# EAGLE design utilidong-lipo-charger-mk-2.1 (EAGLE 6.5.0)
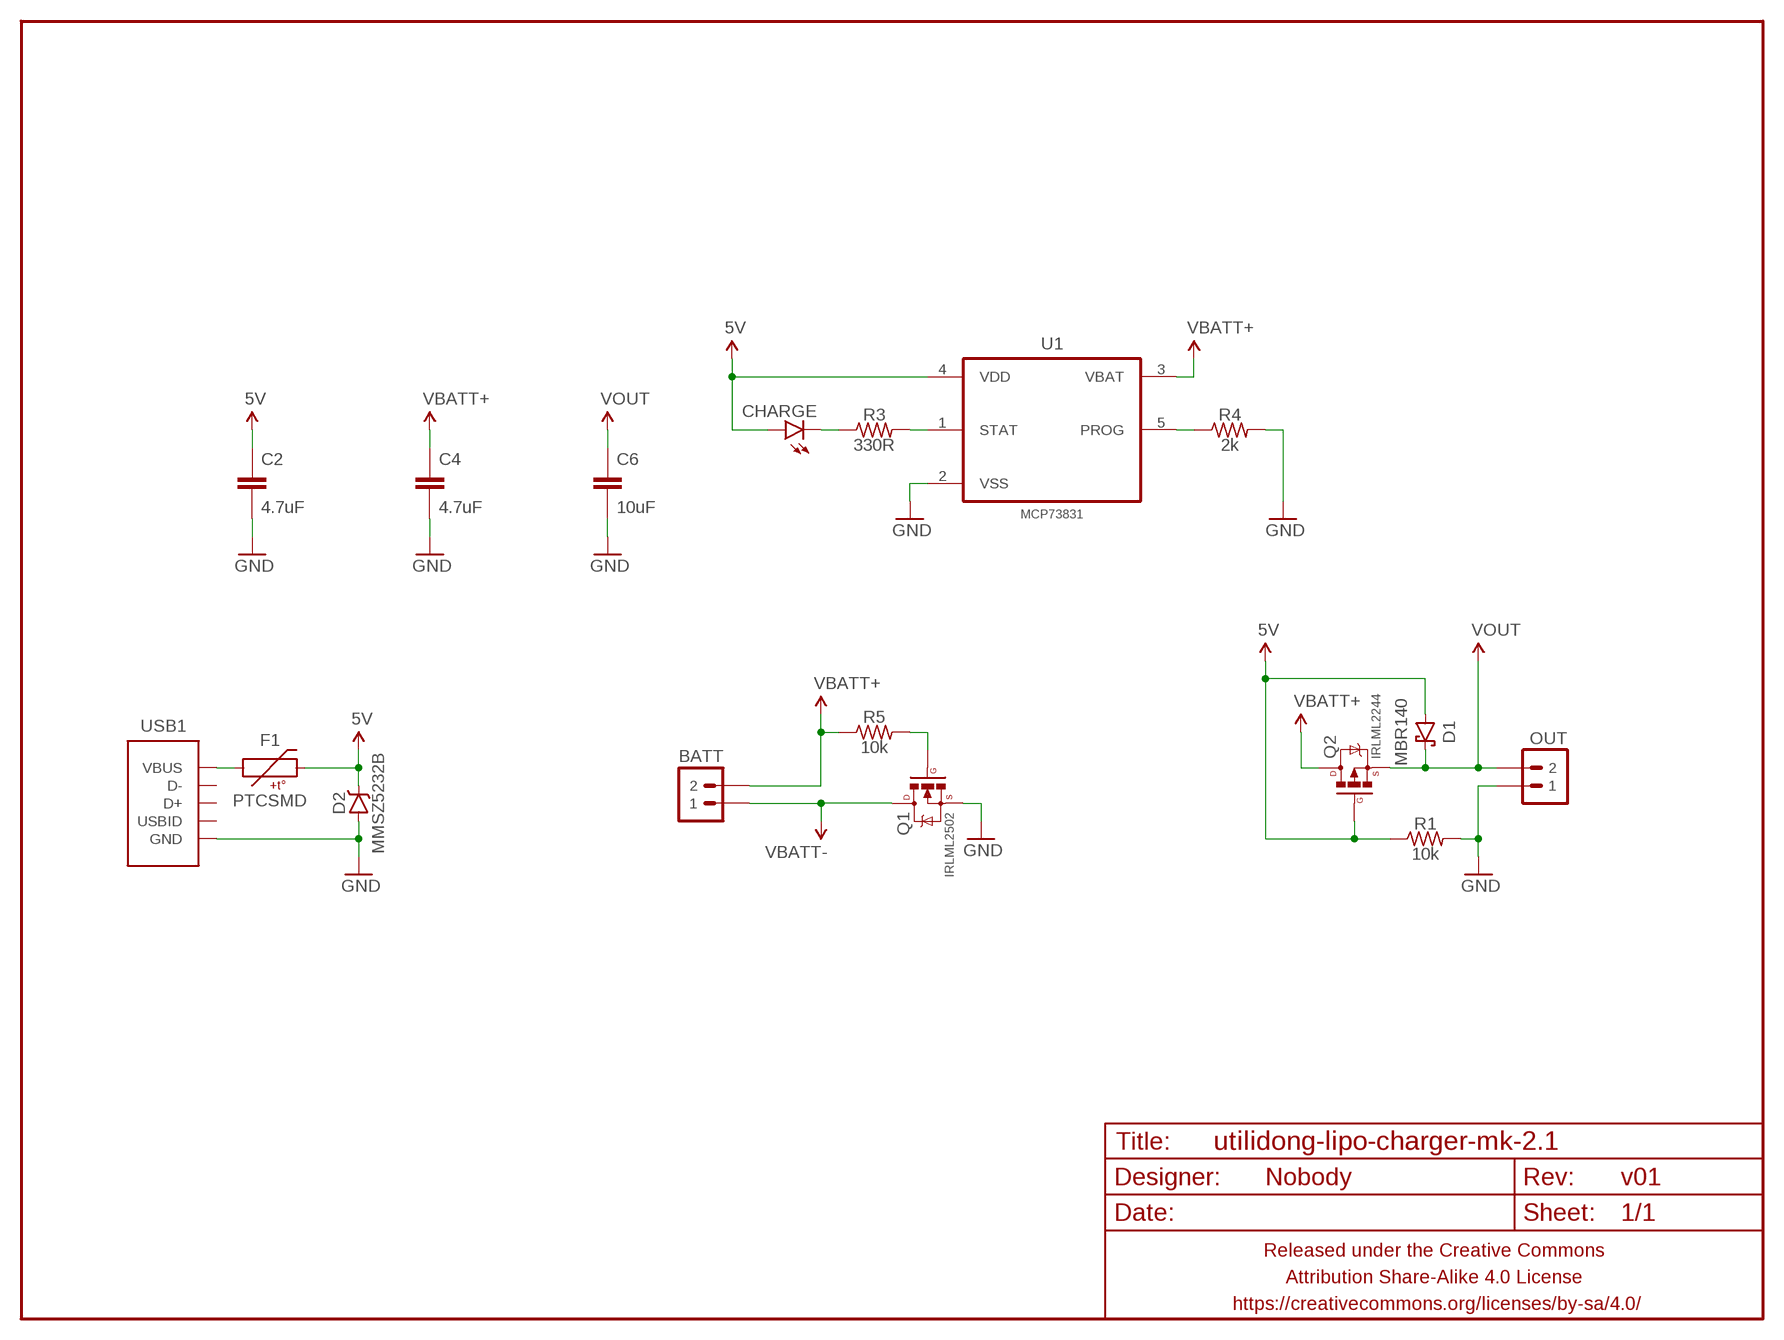
[diagram p0: schematic, sheet 1]

## Parts
BATT  M02PTH-CENTERED-R+  [1X02-CENTER-R+]
C2  4.7uF  CAPACITOR-CERAMICC0805  [C0805]
C4  4.7uF  CAPACITOR-CERAMICC0805  [C0805]
C6  10uF  CAPACITOR-CERAMICC0805  [C0805]
CHARGE  LED1206  [LED-1206]
D1  MBR140  DIODE-SCHOTTKYSMA  [SMA-DIODE-SCHOTTKY]
D2  MMSZ5232B  DIODE-ZENERSOD123  [SOD123-ZENER]
F1  PTCSMD  [PTC-1206]
FRAME1  FRAME-LETTERNO_PACKAGE  [DUMMY]
OUT  M02PTH-CENTERED-R+  [1X02-CENTER-R+]
Q1  IRLML2502  MOSFET-NCHANNELBSS138  [SOT23]
Q2  IRLML2244  MOSFET-PCHANNELIRLML2244  [SOT23-3]
R1  10k  RESISTORR0805  [R0805]
R3  330R  RESISTORR0805  [R0805]
R4  2k  RESISTORR0805  [R0805]
R5  10k  RESISTORR0805  [R0805]
U1  MCP73831  MCP73831T-2ACI/OT  [SOT95P280X145-5N]
USB1  USB-ABCOMBO  [USB-MICRO-B-FCI-CUTOUT]

## Nets
5V: C2.1 CHARGE.A D1.A D2.C F1.2 Q2.1(G) R1.1 U1.4(VDD)
GND: C2.2 C4.2 C6.2 D2.A OUT.1 Q1.2(S) R1.2 R4.2 U1.2(VSS) USB1.5(GND) USB1.P$1(GND) USB1.P$2(GND)
N$2: F1.1 USB1.1(VBUS)
N$5: R3.2 U1.1(STAT)
N$6: CHARGE.C R3.1
N$8: R4.1 U1.5(PROG)
N$11: Q1.1(G) R5.2
VBATT+: BATT.2 C4.1 Q2.3(D) R5.1 U1.3(VBAT)
VBATT-: BATT.1 Q1.3(D)
VOUT: C6.1 D1.C OUT.2 Q2.2(S)
Unconnected: USB1.2(D-) USB1.3(D+) USB1.4(USBID)

## Library data of the parts
BATT OUT = A_butts:M02: Standard 2-pin 0.1" header. Use with - straight break away headers ( PRT-00116) - right angle break away headers (PRT-00553) - swiss pins (PRT-00743) - machine pins (PRT-00117) - female headers (PRT-00115) Molex polarized connector foot print use with: PRT-08233 with associated crimp pins and housings. 2.54_SCREWTERM for use with PRT-10571. 3.5mm Screw Terminal footprints for PRT-08084 5mm Screw Terminal footprints for use with PRT-08433
C2 C4 C6 = A_butts:CAPACITOR-CERAMIC: CAPACITOR, European symbol
CHARGE = A_butts:LED: LEDs Standard schematic elements and footprints for 5mm, 3mm, 1206, and 0603 sized LEDs. 5mm - Spark Fun Electronics SKU : COM-00529 (and others)
D1 = A_butts:DIODE-SCHOTTKY: Schottky diodes in SFE's production catalog BAT20J 1A 23V 0.62Vf RB751 120mA 40V 0.37Vf PMEG4005EJ 0.5A 40V 0.42Vf MBRA140 1A 40V 0.5Vf B340A 3A 40V SMA
D2 = A_butts:DIODE-ZENER: Zener Diode Production Part - 8199 3.4V Zener Voltage
F1 = A_butts:PTC: Resettable Fuse PTC Resettable Fuse. Spark Fun Electronics SKU : COM-08357; PROD_ID: RES-11150
FRAME1 = A_butts:FRAME-LETTER: Schematic Frame Standard 8.5x11 US Letter frame; DESIGNER: Nobody; VERSION: v01
Q1 = A_butts:MOSFET-NCHANNEL: Common NMOSFET Parts MFG P/N Store ID Prod ID FDD8780 TRANS-09984 SI7820DN TRANS-11055 FDS6630A IC-08089 2N7002PW TRANS-11151 FQP30N06L COM-10213 TRANS-10060 BSS123LT1G TRANS-08345 BSS138 TRANS-00830 BS170 2N7000; PROD_ID: TRANS-00830
Q2 = A_butts:MOSFET-PCHANNEL: Generic PMOSFET IRLML2244 - TRANS-11153 (SOT-23 -20V -4.3A) (1.Gate 2.Source 3.Drain) FQP27P06 - COM-10349 <http://www.sparkfun.com/products/10349> (TO-220 -60V -27A) (1.Gate 2.Source 3.Drain); PROD_ID: TRANS-11153
R1 R3-R5 = A_butts:RESISTOR: RESISTOR, American symbol
U1 = A_butts:MCP73831T-2ACI/OT: Charge Management Controller; MPN: MCP73831T-2ACI/OT; OC_FARNELL: 1332158; OC_NEWARK: 56K7045; PACKAGE: SOT-5; SUPPLIER: Microchip
USB1 = A_butts:USB-AB: This is a USB AB connector that is compatible with USB OTG. i.e. this connector can serve as a host or device

## Board
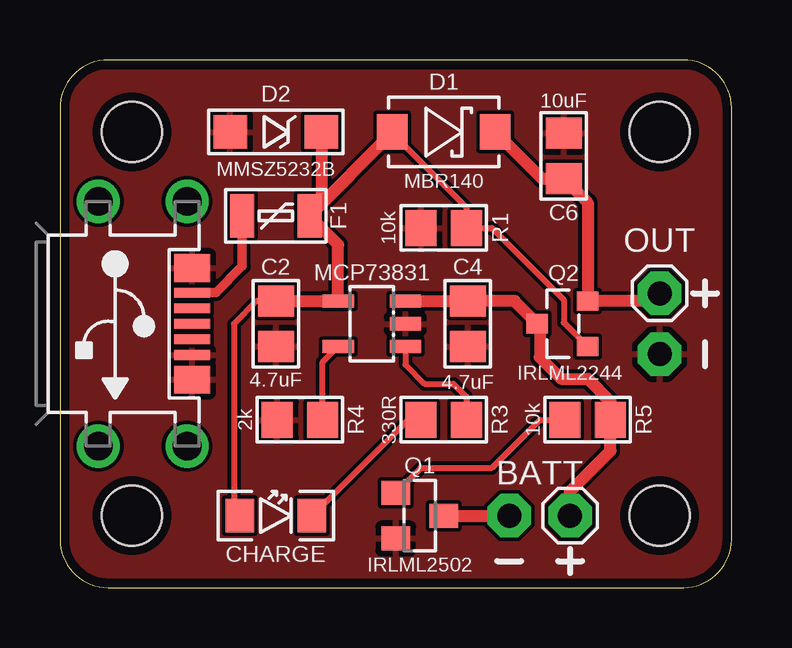
[diagram p1: board, top side]
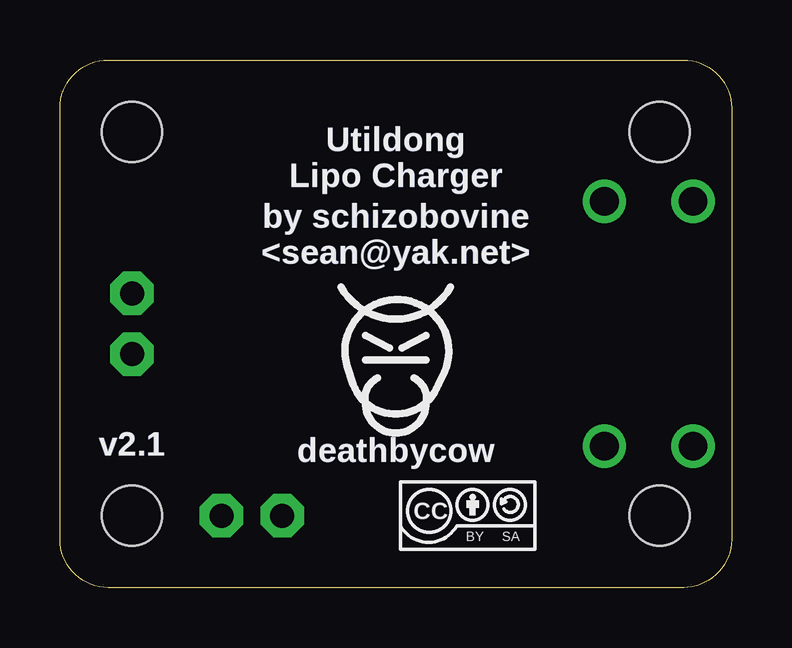
[diagram p2: board, bottom side, seen from below]

Size 28 x 22 mm. Coordinates in mm from the lower left corner, seen from the top.
Outline: 0,20 0,2 arc90 2,0 26,0 arc90 28,2 28,20 arc90 26,22 2,22 arc90 0,20
Copper layers (1*16): Top 0.0356mm / dielectric 1.5011mm / Bottom 0.0356mm
Design rules "LaenPCBOrder_2": minimum track width 6mil, minimum drill 13mil, track to track 6mil, track to pad 6mil, pad to pad 6mil, via to via 6mil, smd to smd 6mil, copper to edge 15mil, drill to drill 6mil, minimum pad ring 7mil, minimum via ring 7mil, stop-mask expansion 3mil, vias tented up to drill 20mil, thermal gap 10mil
Holes 2.5 mm at 3,19 3,3 25,3 25,19

### Footprints (pad centres in the part's own frame; a part is rotated, then mirrored left to right if it is on the bottom)
1X02-CENTER-R+ = drill 1 pad 1.8 octagon: 1 -1.27,0; 2 1.27,0
C0805 = smd 1.3 x 1.5: 1 -0.95,0; 2 0.95,0
LED-1206 = smd 1.2 x 1.4: A -1.5,0; C 1.5,0
SMA-DIODE-SCHOTTKY = smd 1.27 x 1.47: A -2.15,0; C 2.15,0
SOD123-ZENER = smd 1.4 x 1.4: A -1.9,0; C 1.9,0
PTC-1206 = smd 1 x 1.8: 1 -1.4,0; 2 1.4,0
SOT23 = smd 1 x 1.2: 1 -0.95,-1; 2 0.95,-1; 3 0,1
SOT23-3 = smd 0.8 x 0.9: 1 -0.95,-1; 2 0.95,-1; 3 0,1.1
R0805 = smd 1.3 x 1.5: 1 -0.95,0; 2 0.95,0
SOT95P280X145-5N = smd 1.3 x 0.55: 1 -1.4,0.95; 2 -1.4,0; 3 -1.4,-0.95; 4 1.4,-0.95; 5 1.4,0.95
USB-MICRO-B-FCI-CUTOUT = smd 0.4 x 1.5: 1 -1.3,0; 2 -0.65,0; 3 0,0; 4 0.65,0; 5 1.3,0 | smd 1.15 x 1.5: P$1 -2.325,0; P$2 2.325,0 | drill 1.2: P$3 -5.1,-0.2; P$4 5.1,-0.2; P$5 -5.1,-3.9; P$6 5.1,-3.9

### Placement (x,y rotation side)
BATT  20,3 0 top
C2  9,11 270 top
C4  17,11 270 top
C6  21,18 90 top
CHARGE  9,3 0 top
D1  16,19 0 top
D2  9,19 0 top
F1  9,15.5 0 top
FRAME1  0,0 0 top
OUT  25,11 90 top
Q1  15,3 270 top
Q2  21,11 90 top
R1  16,15 180 top
R3  16,7 0 top
R4  10,7 180 top
R5  22,7 180 top
U1  13,11 180 top
U$8  [CC-BY-SA-4.0-NO-URL]  11,3 0 bottom
U$9  [COW_SMALL_METAL]  14,10 0 bottom
USB1  5.5,11 270 top

### Tracks (layer width: path | path; a pad name or v marks a point on that pad's centre or on a via)
5V
  Top 0.25: C2.1 8.2,11.95 7.25,11 7.25,3.25 CHARGE.A | 13.85,18.95 16.95,15.85 R1.1 18,15 21,12 21,11.05 Q2.1
  Top 0.5: F1.2 13.85,18.95 D1.A | D2.C 10.9,16 F1.2 | C2.1 U1.4 11.6,14.3 F1.2
GND
  pour Top: -0.1,-0.1 -0.1,22.1 30.1,22.1 30.1,-0.1
N$2
  Top 0.4: USB1.1 6.5,12.3 7.6,13.4 F1.1
N$5
  Top 0.25: U1.1 14.4,9.3 15.2,8.5 16.4,8.5 16.95,7.95 R3.2
N$6
  Top 0.25: R3.1 14.5,7 CHARGE.C
N$8
  Top 0.25: R4.1 10.95,9.4 U1.5
N$11
  Top 0.25: Q1.1 15.05,5 18,5 20,7 R5.2
VBATT+
  Top 0.5: BATT.2 21.27,4.02 22.95,5.7 R5.1 22.95,7.75 22,8.7 20.9,8.7 20,9.6 20,10.9 Q2.3 18.95,11.95 C4.1 U1.3
VBATT-
  Top 0.5: Q1.3 BATT.1
VOUT
  Top 0.5: OUT.2 24.68,11.95 Q2.2 22,16.05 C6.1 20.1,17.05 D1.C

### Text on the board
Bottom: Utildong / Lipo Charger | by schizobovine / <sean@yak.net>
bPlace: Utildong / Lipo Charger | by schizobovine / <sean@yak.net>